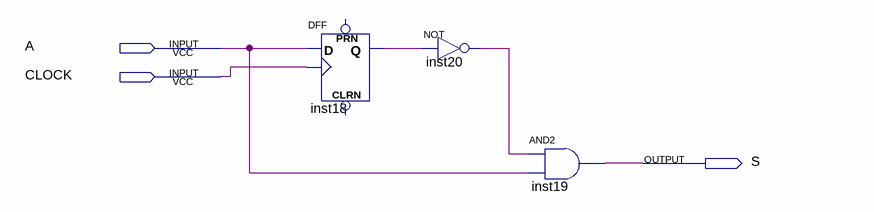
[diagram p0: schematic sheet]
// Quartus schematic detectorFlancoSubida.bdf as structural Verilog: 3 symbols, 3 pins
module detectorFlancoSubida (
  input  A,
  input  CLOCK,
  output S
);

  wire inst18_q, inst20_out;

  DFF inst18 (.CLK(CLOCK), .D(A), .Q(inst18_q));  // open: CLRN, PRN
  not inst20 (inst20_out, inst18_q);
  and inst19 (S, inst20_out, A);
endmodule
